# EAGLE design senseBox-SCD30_V20 (EAGLE 7.7.0)
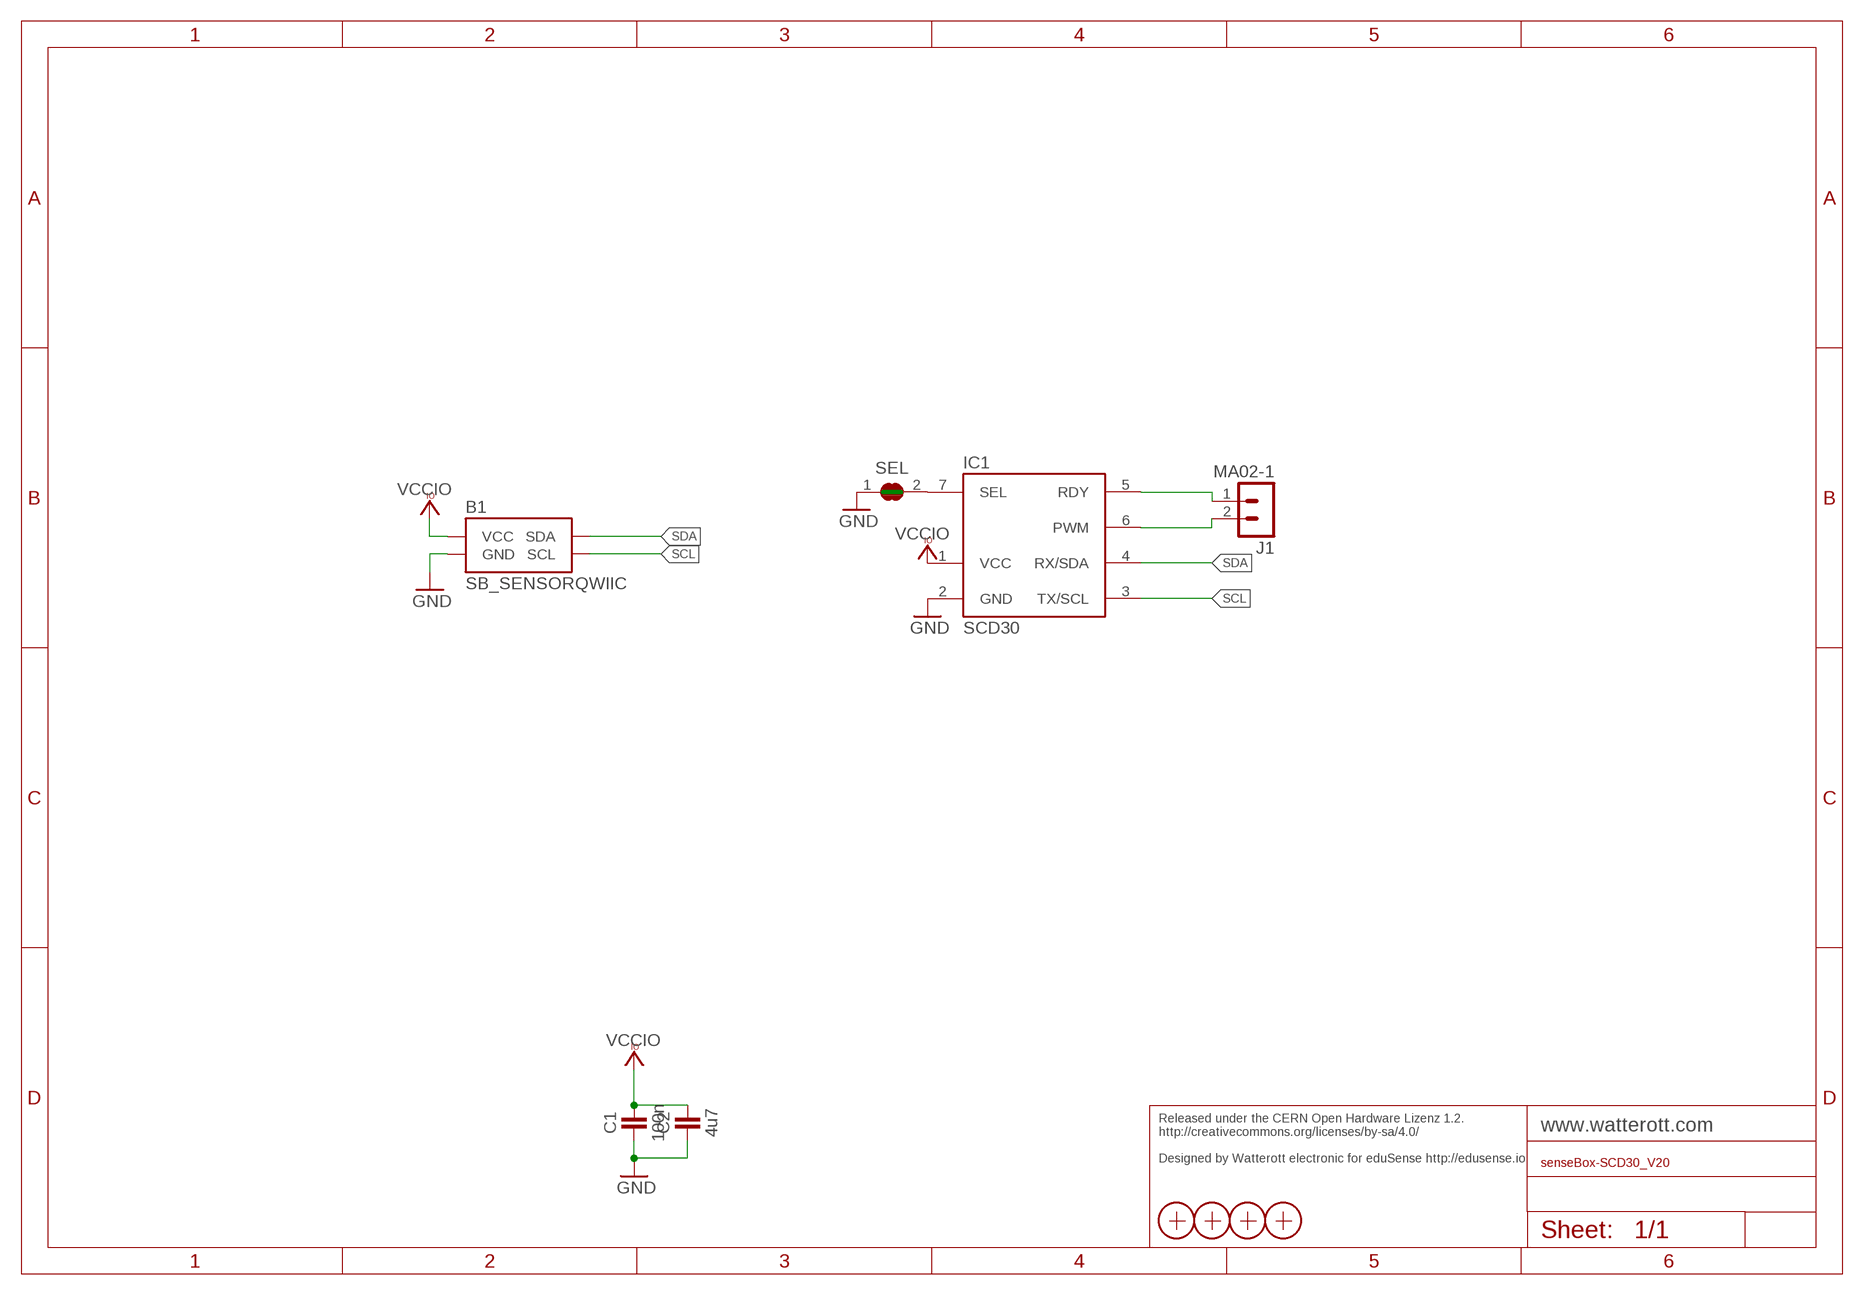
[diagram p0: schematic, sheet 1]

## Parts
B1  SB_SENSORQWIIC  [SB-45X25_QWIIC]
C1  100n  CAPACITOR-0402  [C0402]
C2  4u7  CAPACITOR-0402  [C0402]
IC1  SCD30  [SCD30]
J1  MA02-1  [MA02-1]
SEL  JUMPER2-0402-NC  [JUMPER2-0402_NC]
X1  PASSER-07  [PASSER_07MM]
X2  PASSER-07  [PASSER_07MM]
X3  PASSER-07  [PASSER_07MM]
X4  PASSER-07  [PASSER_07MM]

## Nets
GND: B1.GND B1.GND1(GND) B1.GND2(GND) B1.SHLD1(GND) B1.SHLD2(GND) B1.SHLD3(GND) B1.SHLD4(GND) B1.SHLD5(GND) B1.SHLD6(GND) C1.1 C2.1 IC1.2(GND) SEL.1
N$1: IC1.6(PWM) J1.2
N$3: IC1.7(SEL) SEL.2
RDY: IC1.5(RDY) J1.1
SCL: B1.SCL B1.SCL1(SCL) B1.SCL2(SCL) IC1.3(TX/SCL)
SDA: B1.SDA B1.SDA1(SDA) B1.SDA2(SDA) IC1.4(RX/SDA)
VCCIO: B1.VCC B1.VCC1(VCC) B1.VCC2(VCC) C1.2 C2.2 IC1.1(VCC)

## Notes on the sheet
- Released under the CERN Open Hardware Lizenz 1.2. 
  http://creativecommons.org/licenses/by-sa/4.0/
  
  Designed by Watterott electronic for eduSense http://edusense.io

## Library data of the parts
B1 = we-board:SB_SENSOR: SenseBox Sensors/Breakouts
C1 C2 = we-rcl:CAPACITOR: Capacitors ...2.2uF @ 6.3V -> 0402 ...4.7uF @ 6.3V -> 0603 ...10uF @ 16V -> 0805 ...22uF @ 25V -> 1206
IC1 = we-sensor:SCD30: Sensirion SCD30 CO2, humidity, and temperature sensor
J1 = we-con:MA02-1: Pin Header
SEL = we-rcl:JUMPER2: 2-Pin Jumper
X1-X4 = we-symbol:PASSER: Fiducial Markers

## Board
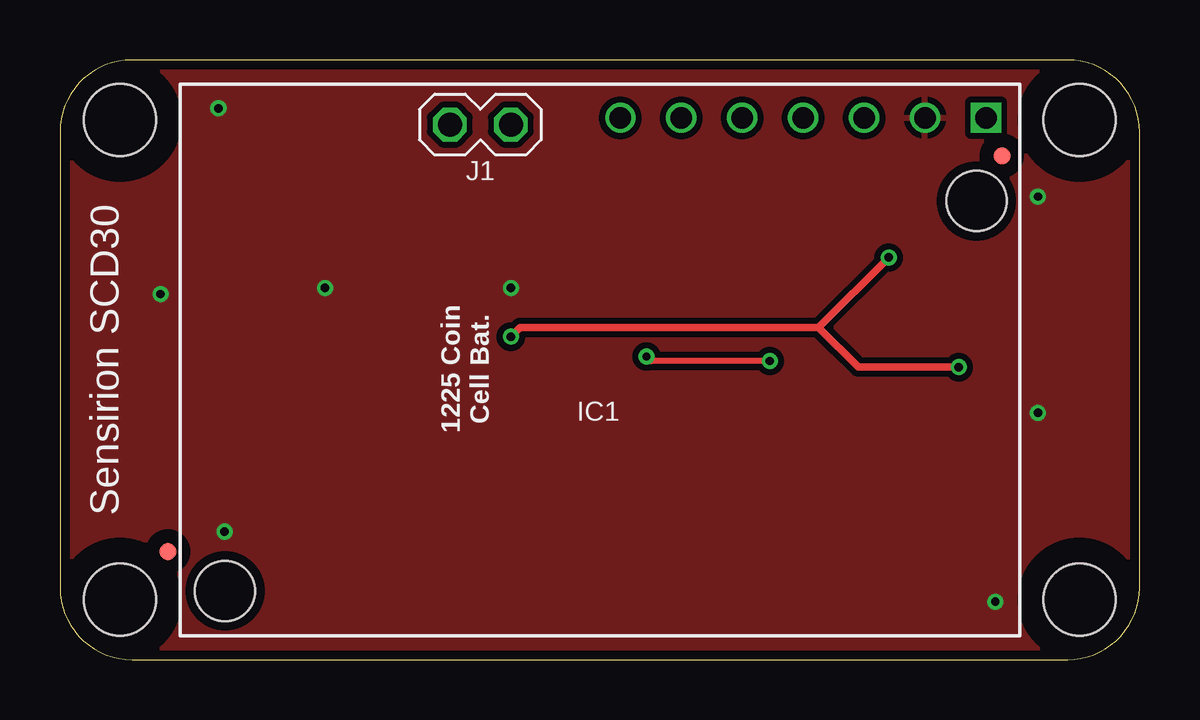
[diagram p1: board, top side]
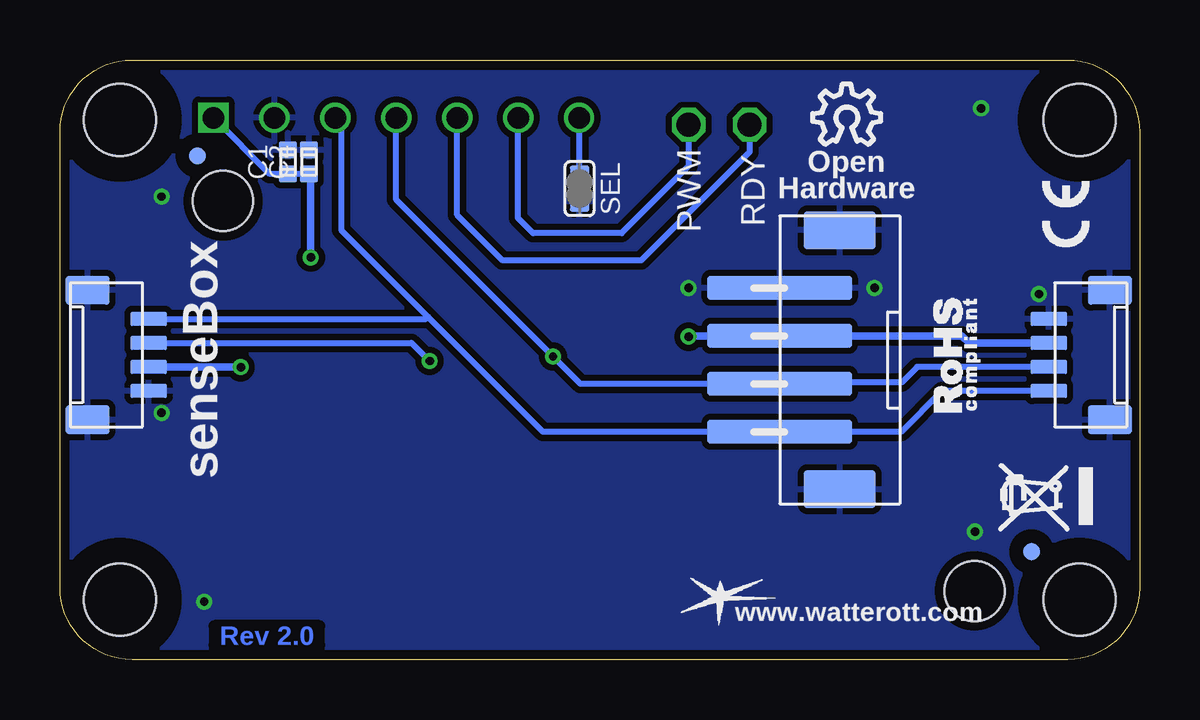
[diagram p2: board, bottom side, seen from below]

Size 45 x 25 mm. Coordinates in mm from the lower left corner, seen from the top.
Copper layers (1*16): Top 0.035mm / dielectric 1.5mm / Bottom 0.035mm
Design rules "we-dru-2-layer": minimum track width 0.15mm, minimum drill 0.3mm, track to track 0.15mm, track to pad 0.15mm, pad to pad 0.15mm, via to via 0.15mm, smd to smd 0.1mm, copper to edge 0.4mm, drill to drill 0.2mm, minimum pad ring 0.18mm, minimum via ring 0.16mm, stop-mask expansion 0.1mm, vias tented up to drill 0.5mm, thermal gap 0.25mm

### Footprints (pad centres in the part's own frame; a part is rotated, then mirrored left to right if it is on the bottom)
SB-45X25_QWIIC = smd 6 x 1 bottom: GND 15,15.5; SCL 15,9.5; SDA 15,11.5; VCC 15,13.5 | smd 1.5 x 0.6 bottom: GND1 41.303,11.2; GND2 3.782,14.2; SCL1 41.303,14.2; SCL2 3.782,11.2; SDA1 41.303,13.2; SDA2 3.782,12.2; VCC1 41.303,12.2; VCC2 3.782,13.2 | smd 3 x 1.6 bottom: SHLD1 12.5,17.9; SHLD2 12.5,7.1 | smd 1.8 x 1.2 bottom: SHLD3 43.853,10; SHLD4 43.853,15.4; SHLD5 1.232,15.4; SHLD6 1.232,10 | hole 3: 2.5,22.5; 2.5,2.5; 42.5,22.5; 42.5,2.5
C0402 = smd 0.75 x 0.7: 1 0,0.5; 2 0,-0.5
SCD30 = drill 0.9 square: 1 -16.1,-10.09 | drill 0.9: 2 -13.56,-10.09; 3 -11.02,-10.09; 4 -8.48,-10.09; 5 -5.94,-10.09; 6 -3.4,-10.09; 7 -0.86,-10.09 | hole 2.5: -15.7,-6.62; 15.62,9.64
MA02-1 = drill 1 octagon: 1 0,1.27; 2 0,-1.27
JUMPER2-0402_NC = smd 0.8 x 0.8: 1 0,0.55; 2 0,-0.55
PASSER_07MM = smd 0.7 x 0.7: X 0,0

### Placement (x,y rotation side)
B1  0,0 0 top
C1  35.5,20.75 0 bottom
C2  34.62,20.75 0 bottom
IC1  22.5,12.5 180 top
J1  17.52,22.3 90 top
SEL  23.34,19.64 180 bottom
X1  4.5,4.5 180 top
X2  39.26,21.01 180 top
X3  39.26,21.01 180 bottom
X4  4.5,4.5 180 bottom

### Tracks (layer width: path | path; a pad name or v marks a point on that pad's centre or on a via)
GND  (via drill 0.35)
  other vias: 6.6,22.99 6.86,5.33 38.99,2.41 40.77,19.3 11.05,15.49 18.8,15.49 4.19,15.24 40.77,10.29
  pour Top (isolate 0.254): 45,0 0,0 0,25 45,25
  pour Bottom (isolate 0.254): 45,0 0,0 0,25 45,25
N$1
  Bottom 0.254: J1.2 18.79,20.58 21.59,17.78 25.27,17.78 25.91,18.41 IC1.6
N$2
  Bottom 0.2: 23.37,19.18 23.37,20.19
N$3
  Bottom 0.254: SEL.2 23.34,22.57 IC1.7
RDY
  Bottom 0.254: J1.1 16.25,21.16 20.78,16.64 26.54,16.64 28.44,18.53 IC1.5
SCL
  Bottom 0.254: 29.65,14.29 24.87,9.5 B1.SCL 9.93,9.5 8.23,11.2 B1.SCL2 | 29.65,14.29 33.27,17.91 33.27,22.34 IC1.3 | B1.SCL1 29.74,14.2 29.65,14.29
SDA  (via drill 0.35)
  Top 0.254: v29.59,12.45 24.64,12.45 v24.45,12.64
  Bottom 0.2: 14.94,11.56 B1.SDA
  Bottom 0.254: B1.SDA 23.31,11.5 v24.45,12.64 30.99,19.18 IC1.4 | B1.SDA2 9.26,12.2 9.91,11.56 14.94,11.56 | B1.SDA1 30.34,13.2 v29.59,12.45
VCCIO  (via drill 0.35)
  Top 0.305: 31.62,13.84 19.18,13.84 v18.8,13.46 | 31.62,13.84 v34.54,16.76 | v37.47,12.19 33.27,12.19 31.62,13.84
  Bottom 0.2: v37.47,12.2 v37.47,12.19
  Bottom 0.254: 18.76,13.5 v18.8,13.46 | 34.54,20.17 C2.2 C1.2 36.26,20.25 IC1.1
  Bottom 0.305: 18.76,13.5 B1.VCC 7.4,13.5 7.1,13.2 B1.VCC2 | v34.54,16.76 34.54,20.17 | B1.VCC1 v37.47,12.2

### Text on the board
Bottom: Rev 2.0
tPlace: Sensirion SCD30 | 1225 Coin / Cell Bat.
bPlace: RDY | PWM
Reference: Silkscreen: 21 tPlace + 22 bPlace